# EAGLE design digiadb (EAGLE 9.0.1)
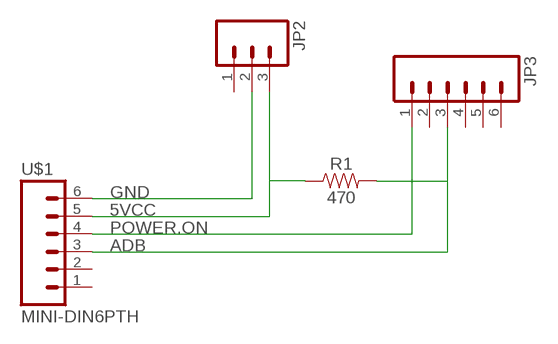
[diagram p0: schematic, sheet 1]

## Parts
JP2  M03PTH  [1X03]
JP3  M06SIP  [1X06]
R1  470  470OHM-0603-1/10W-1%  [0603]
U$1  MINI-DIN6PTH  [MINI-DIN6]

## Nets
5VCC: JP2.3 R1.1 U$1.5
ADB: JP3.3 R1.2 U$1.3
GND: JP2.2 U$1.6
POWER.ON: JP3.1 U$1.4
Unconnected: JP2.1 JP3.2 JP3.4 JP3.5 JP3.6 U$1.1 U$1.2

## Library data of the parts
JP2 = SparkFun:M03: Header 3 Standard 3-pin 0.1" header. Use with straight break away headers (SKU : PRT-00116), right angle break away headers (PRT-00553), swiss pins (PRT-00743), machine pins (PRT-00117), and female headers (PRT-00115). Molex polarized connector foot print use with SKU : PRT-08232 with associated crimp pins and housings.
JP3 = SparkFun:M06: Header 6 Standard 6-pin 0.1" header. Use with straight break away headers (SKU : PRT-00116), right angle break away headers (PRT-00553), swiss pins (PRT-00743), machine pins (PRT-00117), and female headers (PRT-00115). Molex polarized connector foot print use with SKU : PRT-08094 with associated crimp pins and housings. NOTES ON THE VARIANTS LOCK and LOCK_LONGPADS... This footprint was designed to help hold the alignment of a through-hole component (i.e. 6-pin header) while soldering it into place. You may notice that each hole has been shifted either up or down by 0.005 of an inch from it's more standard position (which is a perfectly straight line). This slight alteration caused the pins (the squares in the middle) to touch the edges of the holes. Because they are alternating, it causes a "brace" to hold the component in place. 0.005 has proven to be the perfect amount of "off-center" position when using our standard breakaway headers. Although looks a little odd when you look at the bare footprint, once you have a header in there, the alteration is very hard to notice. Also, if you push a header all the way into place, it is covered up entirely on the bottom side. This idea of altering the position of holes to aid alignment will be further integrated into the Sparkfun Library for other footprints. It can help hold any component with 3 or more connection pins.
R1 = SparkFun-Resistors:470OHM: 470Ω resistor A resistor is a passive two-terminal electrical component that implements electrical resistance as a circuit element. Resistors act to reduce current flow, and, at the same time, act to lower voltage levels within circuits. - Wikipedia; PROD_ID: RES-07869
U$1 = SparkFun-Connectors:MINI-DIN6: mini DIN 6 Connector Commonly found on the back of a computer for PS2 keyboard and mice. Schematic and footprint are proven. Spark Fun Electronics SKU : PRT-08509

## Board
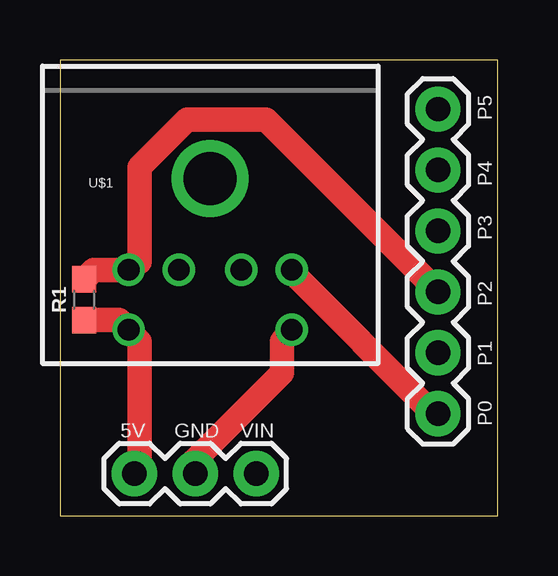
[diagram p1: board, top side]

Size 18.25 x 19 mm. Coordinates in mm from the lower left corner, seen from the top.
Outline: 0,19 0,0 18.25,0 18.25,19 0,19
Copper layers (1*16): Top 0.0356mm / dielectric 1.5011mm / Bottom 0.0356mm
Design rules "default": minimum track width 40mil, minimum drill 13mil, track to track 12mil, track to pad 12mil, pad to pad 12mil, via to via 12mil, smd to smd 8mil, copper to edge 15mil, drill to drill 12mil, minimum pad ring 7mil, minimum via ring 7mil, stop-mask expansion 4mil, vias tented up to drill 24mil, thermal gap 10mil

### Footprints (pad centres in the part's own frame; a part is rotated, then mirrored left to right if it is on the bottom)
1X03 = drill 1.016 pad 1.88: 1 0,0; 2 2.54,0; 3 5.08,0
1X06 = drill 1.016 pad 1.88: 1 0,0; 2 2.54,0; 3 5.08,0; 4 7.62,0; 5 10.16,0; 6 12.7,0
0603 = smd 1.1 x 1: 1 -0.85,0; 2 0.85,0
MINI-DIN6 = drill 0.9: 1 -1.3,-8.5; 2 1.3,-8.5; 3 -3.4,-8.5; 4 3.4,-8.5; 5 -3.4,-11; 6 3.4,-11 | drill 2.2: P$1 0,-4.7

### Placement (x,y rotation side)
JP2  8.17,1.75 180 top
JP3  15.75,4.25 90 top
R1  1,9 90 top
U$1  6.25,18.75 0 top

### Tracks (layer width: path | path; a pad name or v marks a point on that pad's centre or on a via)
5VCC
  Top 1.016: JP2.3 3.3,1.98 3.3,7.26 U$1.5 2.45,8.15 R1.1
ADB
  Top 1.016: JP3.3 15.19,9.91 8.59,16.51 5.28,16.51 3.3,14.53 3.3,10.57 U$1.3 1.4,10.25 R1.2
GND
  Top 1.016: U$1.6 9.25,7.26 9.25,5.94 5.28,1.98 JP2.2
POWER.ON
  Top 1.016: U$1.4 9.91,9.91 15.19,4.62 JP3.1

### Text on the board
tPlace: 5V | GND | VIN
tNames: P5 | P4 | P3 | P2 | P1 | P0
bNames: P5 | P4 | P3 | P2 | P1 | P0